# Altium schematic sheet Ada4Arm.SchDoc
size A4
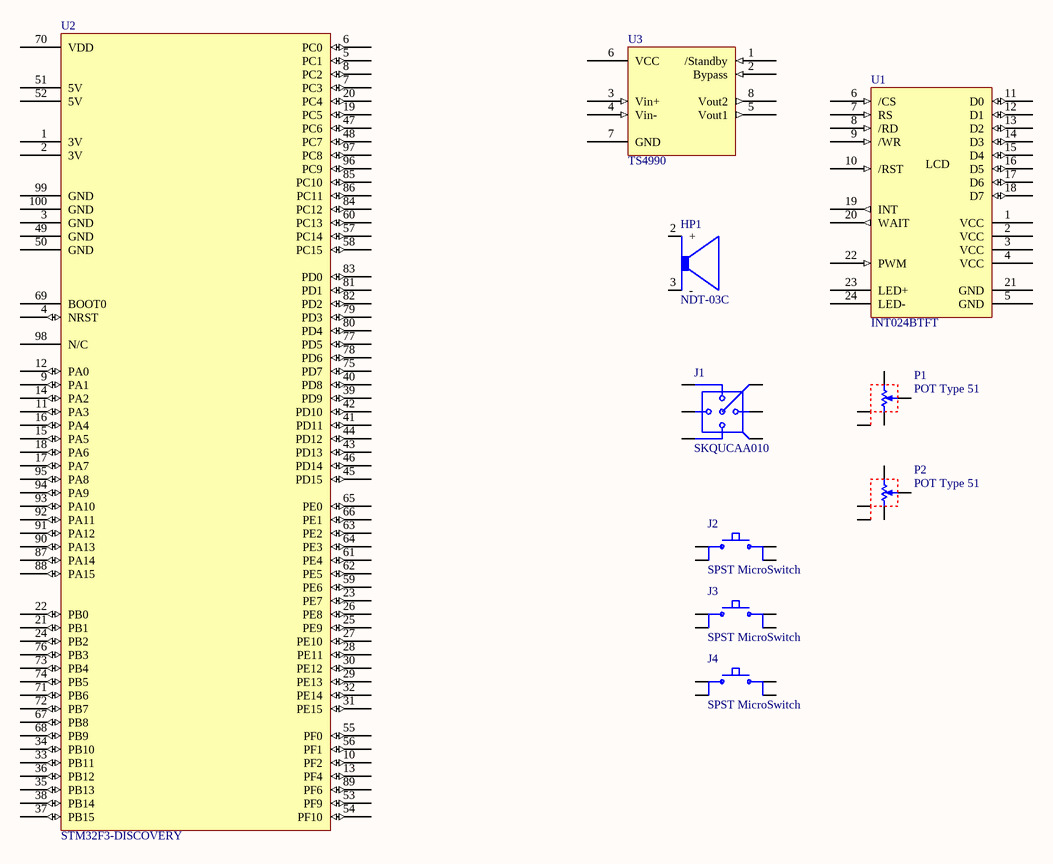
[diagram p0: Ada4Arm.SchDoc]

## Parts
HP1  NDT-03C  [NDT-03C]
J1  SKQUCAA010  [SKQUCAA010]
J2  SPST MicroSwitch  [SPST_MicroSwitch]
J3  SPST MicroSwitch  [SPST_MicroSwitch]
J4  SPST MicroSwitch  [SPST_MicroSwitch]
P1  POT Type 51  [POT Type 51]
P2  POT Type 51  [POT Type 51]
U1  INT024BTFT  [INT024BTFT]
U2  STM32F3-DISCOVERY  [STM32F3-DISCOVERY]
U3  TS4990  [MiniSOP-8]

## Nets

Not connected (* = marked no-connect by the designer): HP1 2(+) 3(-); J1 1(UP) 2(LEFT) 3(DOWN) 4(COMMON) 5(RIGHT) 6(CENTER); J2 1 2 3 4; J3 1 2 3 4; J4 1 2 3 4; P1 1 2 3 4(GND) 5(GND); P2 1 2 3 4(GND) 5(GND); U1 1(VCC) 2(VCC) 3(VCC) 4(VCC) 5(GND) 6(/CS) 7(RS) 8(/RD) 9(/WR) 10(/RST) 11(D0) 12(D1) 13(D2) 14(D3) 15(D4) 16(D5) 17(D6) 18(D7) 19(INT) 20(WAIT) 21(GND) 22(PWM) 23(LED+) 24(LED-); U2 1(3V) 2(3V) 3(GND) 4(NRST) 5(PC1) 6(PC0) 7(PC3) 8(PC2) 9(PA1) 10(PF2) 11(PA3) 12(PA0) 13(PF4) 14(PA2) 15(PA5) 16(PA4) 17(PA7) 18(PA6) 19(PC5) 20(PC4) 21(PB1) 22(PB0) 23(PE7) 24(PB2) 25(PE9) 26(PE8) 27(PE10) 28(PE11) 29(PE13) 30(PE12) 31(PE15) 32(PE14) 33(PB11) 34(PB10) 35(PB13) 36(PB12) 37(PB15) 38(PB14) 39(PD9) 40(PD8) 41(PD11) 42(PD10) 43(PD13) 44(PD12) 45(PD15) 46(PD14) 47(PC6) 48(PC7) 49(GND) 50(GND) 51(5V) 52(5V) 53(PF9) 54(PF10) 55(PF0) 56(PF1) 57(PC14) 58(PC15) 59(PE6) 60(PC13) 61(PE4) 62(PE5) 63(PE2) 64(PE3) 65(PE0) 66(PE1) 67(PB8) 68(PB9) 69(BOOT0) 70(VDD) 71(PB6) 72(PB7) 73(PB4) 74(PB5) 75(PD7) 76(PB3) 77(PD5) 78(PD6) 79(PD3) 80(PD4) 81(PD1) 82(PD2) 83(PD0) 84(PC12) 85(PC10) 86(PC11) 87(PA14) 88(PA15) 89(PF6) 90(PA13) 91(PA12) 92(PA11) 93(PA10) 94(PA9) 95(PA8) 96(PC9) 97(PC8) 98(N/C) 99(GND) 100(GND); U3 1(/Standby) 2(Bypass) 3(Vin+) 4(Vin-) 5(Vout1) 6(VCC) 7(GND) 8(Vout2)

## Notes on the sheet
- (in symbol LCD INT024BTFT) LCD

## Library data of the parts
HP1 = NDT-03C: Audio HP
J1 = SKQUCAA010: 4 ways + center switch
J2-J4 = SPST MicroSwitch: SPST - MicroSwitch
P1 P2 = POT Type 51: 25mm Diameter potentiometer
U1 = LCD INT024BTFT